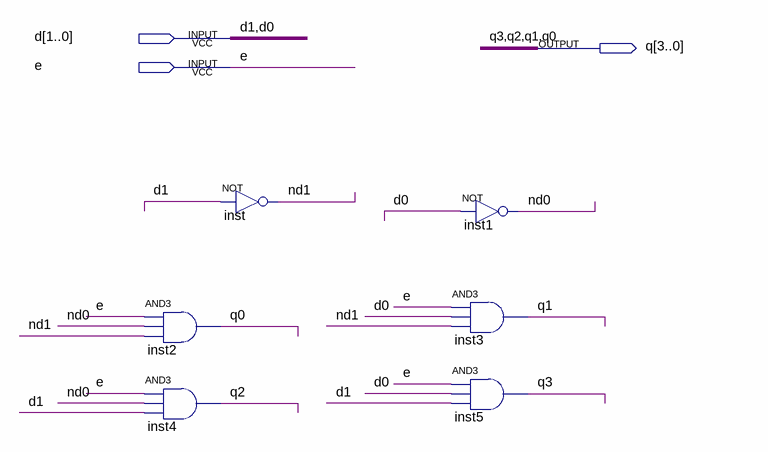
[diagram p0: schematic sheet]
// Quartus schematic s31_dc.bdf as structural Verilog: 6 symbols, 3 pins
module s31_dc (
  input  [1:0] d,
  input  e,
  output [3:0] q
);

  wire nd0, nd1;

  and inst2 (q[0], e, nd0, nd1);
  and inst4 (q[2], e, nd0, d[1]);
  not inst (nd1, d[1]);
  not inst1 (nd0, d[0]);
  and inst3 (q[1], e, d[0], nd1);
  and inst5 (q[3], e, d[0], d[1]);
endmodule
